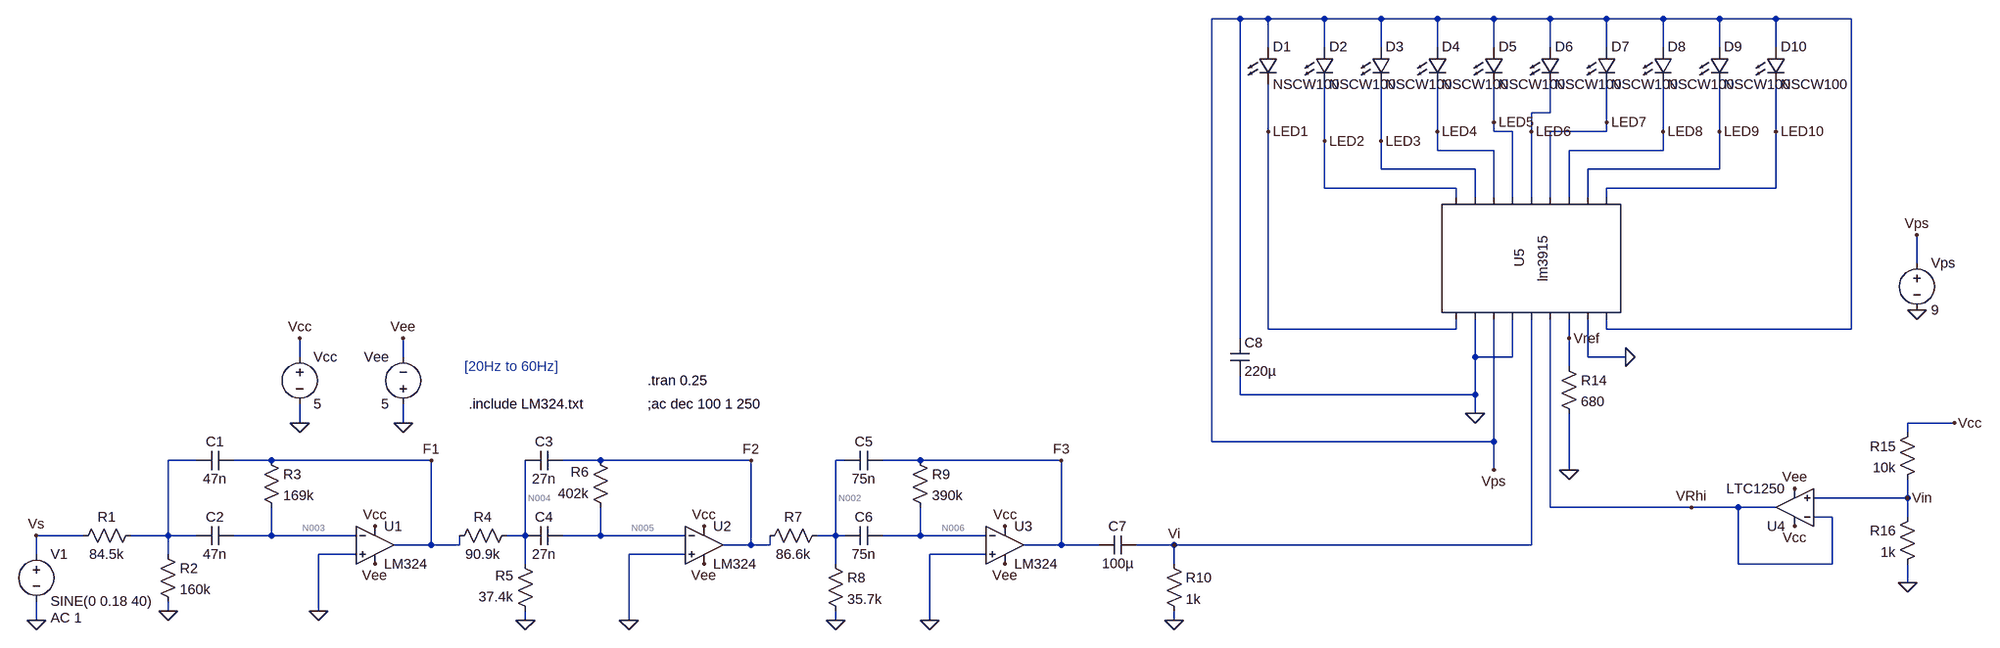
[diagram p0: schematic FinalSubBassFilterWithLEDDriver.asc]
* FinalSubBassFilterWithLEDDriver.asc
R1 N001 Vs 84.5k
V1 Vs 0 SINE(0 0.18 40) AC 1
R2 N001 0 160k
R3 F1 N003 169k
R4 N004 F1 90.9k
R5 0 N004 37.4k
R6 N005 F2 402k
R7 F2 N002 86.6k
R8 N002 0 35.7k
R9 F3 N006 390k
C1 F1 N001 47n
C2 N003 N001 47n
C3 F2 N004 27n
C4 N005 N004 27n
C5 F3 N002 75n
C6 N006 N002 75n
XU1 0 N003 Vcc Vee F1 LM324  ; pins In+ In- V+ V- OUT
XU2 0 N005 Vcc Vee F2 LM324  ; pins In+ In- V+ V- OUT
XU3 0 N006 Vcc Vee F3 LM324  ; pins In+ In- V+ V- OUT
Vcc Vcc 0 5
Vee 0 Vee 5
C7 Vi F3 100µ
R10 Vi 0 1k
D1 Vps LED1 NSCW100
D2 Vps LED2 NSCW100
D3 Vps LED3 NSCW100
D4 Vps LED4 NSCW100
D5 Vps LED5 NSCW100
D6 Vps LED6 NSCW100
D7 Vps LED7 NSCW100
D8 Vps LED8 NSCW100
D9 Vps LED9 NSCW100
D10 Vps LED10 NSCW100
C8 Vps 0 220µ
Vps Vps 0 9
* U5: lm3915 (symbol AutoGenerated\lm3915 not available, pins judged from their places): pin1=LED1 pin2=0 pin3=Vps pin4=0 pin5=Vi pin6=VRhi pin7=Vref pin8=0 pin9=Vps pin10=LED2 pin11=LED3 pin12=LED4 pin13=LED5 pin14=LED6 pin15=LED7 pin16=LED8 pin17=LED9 pin18=LED10
R14 Vref 0 680
R15 Vcc Vin 10k
R16 Vin 0 1k
XU4 Vin VRhi Vcc Vee VRhi LTC1250  ; pins In+ In- V+ V- OUT
.model D D
.lib standard.dio
.tran 0.25
;ac dec 100 1 250
* [20Hz to 60Hz]
.include LM324.txt
.backanno
.end

* Results of the author's LTspice run, read from the files saved beside the schematic
* Operating Point, zero values left out:
*   V(f1) = -3.404 mV
*   V(n003) = -33.62 µV
*   V(n004) = -992.3 µV
*   V(n005) = -33.57 µV
*   V(f2) = -8.051 mV
*   V(n002) = -2.35 mV
*   V(f3) = -7.812 mV
*   V(n006) = -33.58 µV
*   V(vee) = -5 V
*   V(vcc) = 5 V
*   V(vi) = -25 µV
*   V(vps) = 9 V
*   V(led1) = 7.98 V
*   V(led2) = 7.98 V
*   V(led3) = 7.98 V
*   V(led4) = 7.98 V
*   V(led5) = 7.98 V
*   V(led6) = 7.98 V
*   V(led7) = 7.98 V
*   V(led8) = 7.98 V
*   V(led9) = 7.98 V
*   V(led10) = 7.98 V
*   V(vref) = 1.192 V
*   V(vrhi) = 454.5 mV
*   V(vin) = 454.5 mV
*   I(D10) = 1 µA
*   I(D9) = 1 µA
*   I(D8) = 1 µA
*   I(D7) = 1 µA
*   I(D6) = 1 µA
*   I(D5) = 1 µA
*   I(D4) = 1 µA
*   I(D3) = 1 µA
*   I(D2) = 1 µA
*   I(D1) = 1 µA
*   I(R16) = 454.5 µA
*   I(R15) = 454.5 µA
*   I(R14) = 1.753 mA
*   I(R10) = -25 nA
*   I(R9) = -19.94 nA
*   I(R8) = -65.83 nA
*   I(R7) = -65.83 nA
*   I(R6) = 19.94 nA
*   I(R5) = 26.53 nA
*   I(R4) = 26.53 nA
*   I(R3) = -19.94 nA
*   I(Vps) = -10.45 mA
*   I(Vee) = -4.012 mA
*   I(Vcc) = -4.483 mA
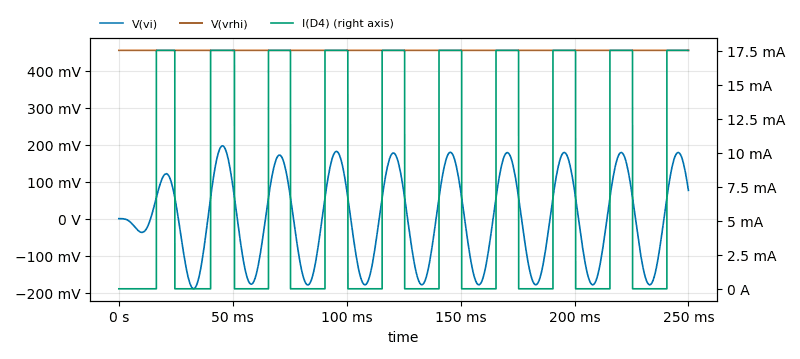
[diagram p1: Transient Analysis of FinalSubBassFilterWithLEDDriver.asc, plotted from the saved traces]
* Transient Analysis, 1 run:
*   V(vi): min -189.5 mV, max 196.7 mV, average 2.545 mV, rms 122.4 mV, last 76.34 mV
*   V(vrhi): min 454.5 mV, max 454.5 mV, average 454.5 mV, rms 454.5 mV, last 454.5 mV
*   I(D4): min 1 µA, max 17.54 mA, average 6.824 mA, rms 10.94 mA, last 17.54 mA